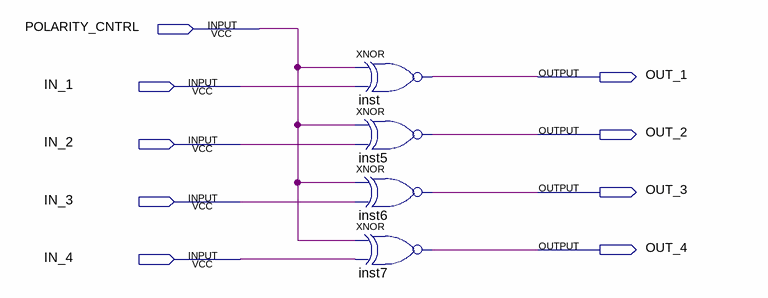
[diagram p0: schematic sheet]
// Quartus schematic Polarity_gates.bdf as structural Verilog: 4 symbols, 9 pins
module Polarity_gates (
  input  POLARITY_CNTRL,
  input  IN_1,
  input  IN_2,
  input  IN_3,
  input  IN_4,
  output OUT_1,
  output OUT_2,
  output OUT_3,
  output OUT_4
);

  xnor inst (OUT_1, POLARITY_CNTRL, IN_1);
  xnor inst5 (OUT_2, POLARITY_CNTRL, IN_2);
  xnor inst6 (OUT_3, POLARITY_CNTRL, IN_3);
  xnor inst7 (OUT_4, POLARITY_CNTRL, IN_4);
endmodule
